# EasyEDA Pro project 双向DCDC.eprj

# Schematic Schematic1
Board Name: Board1; Create Date: 2025-02-20
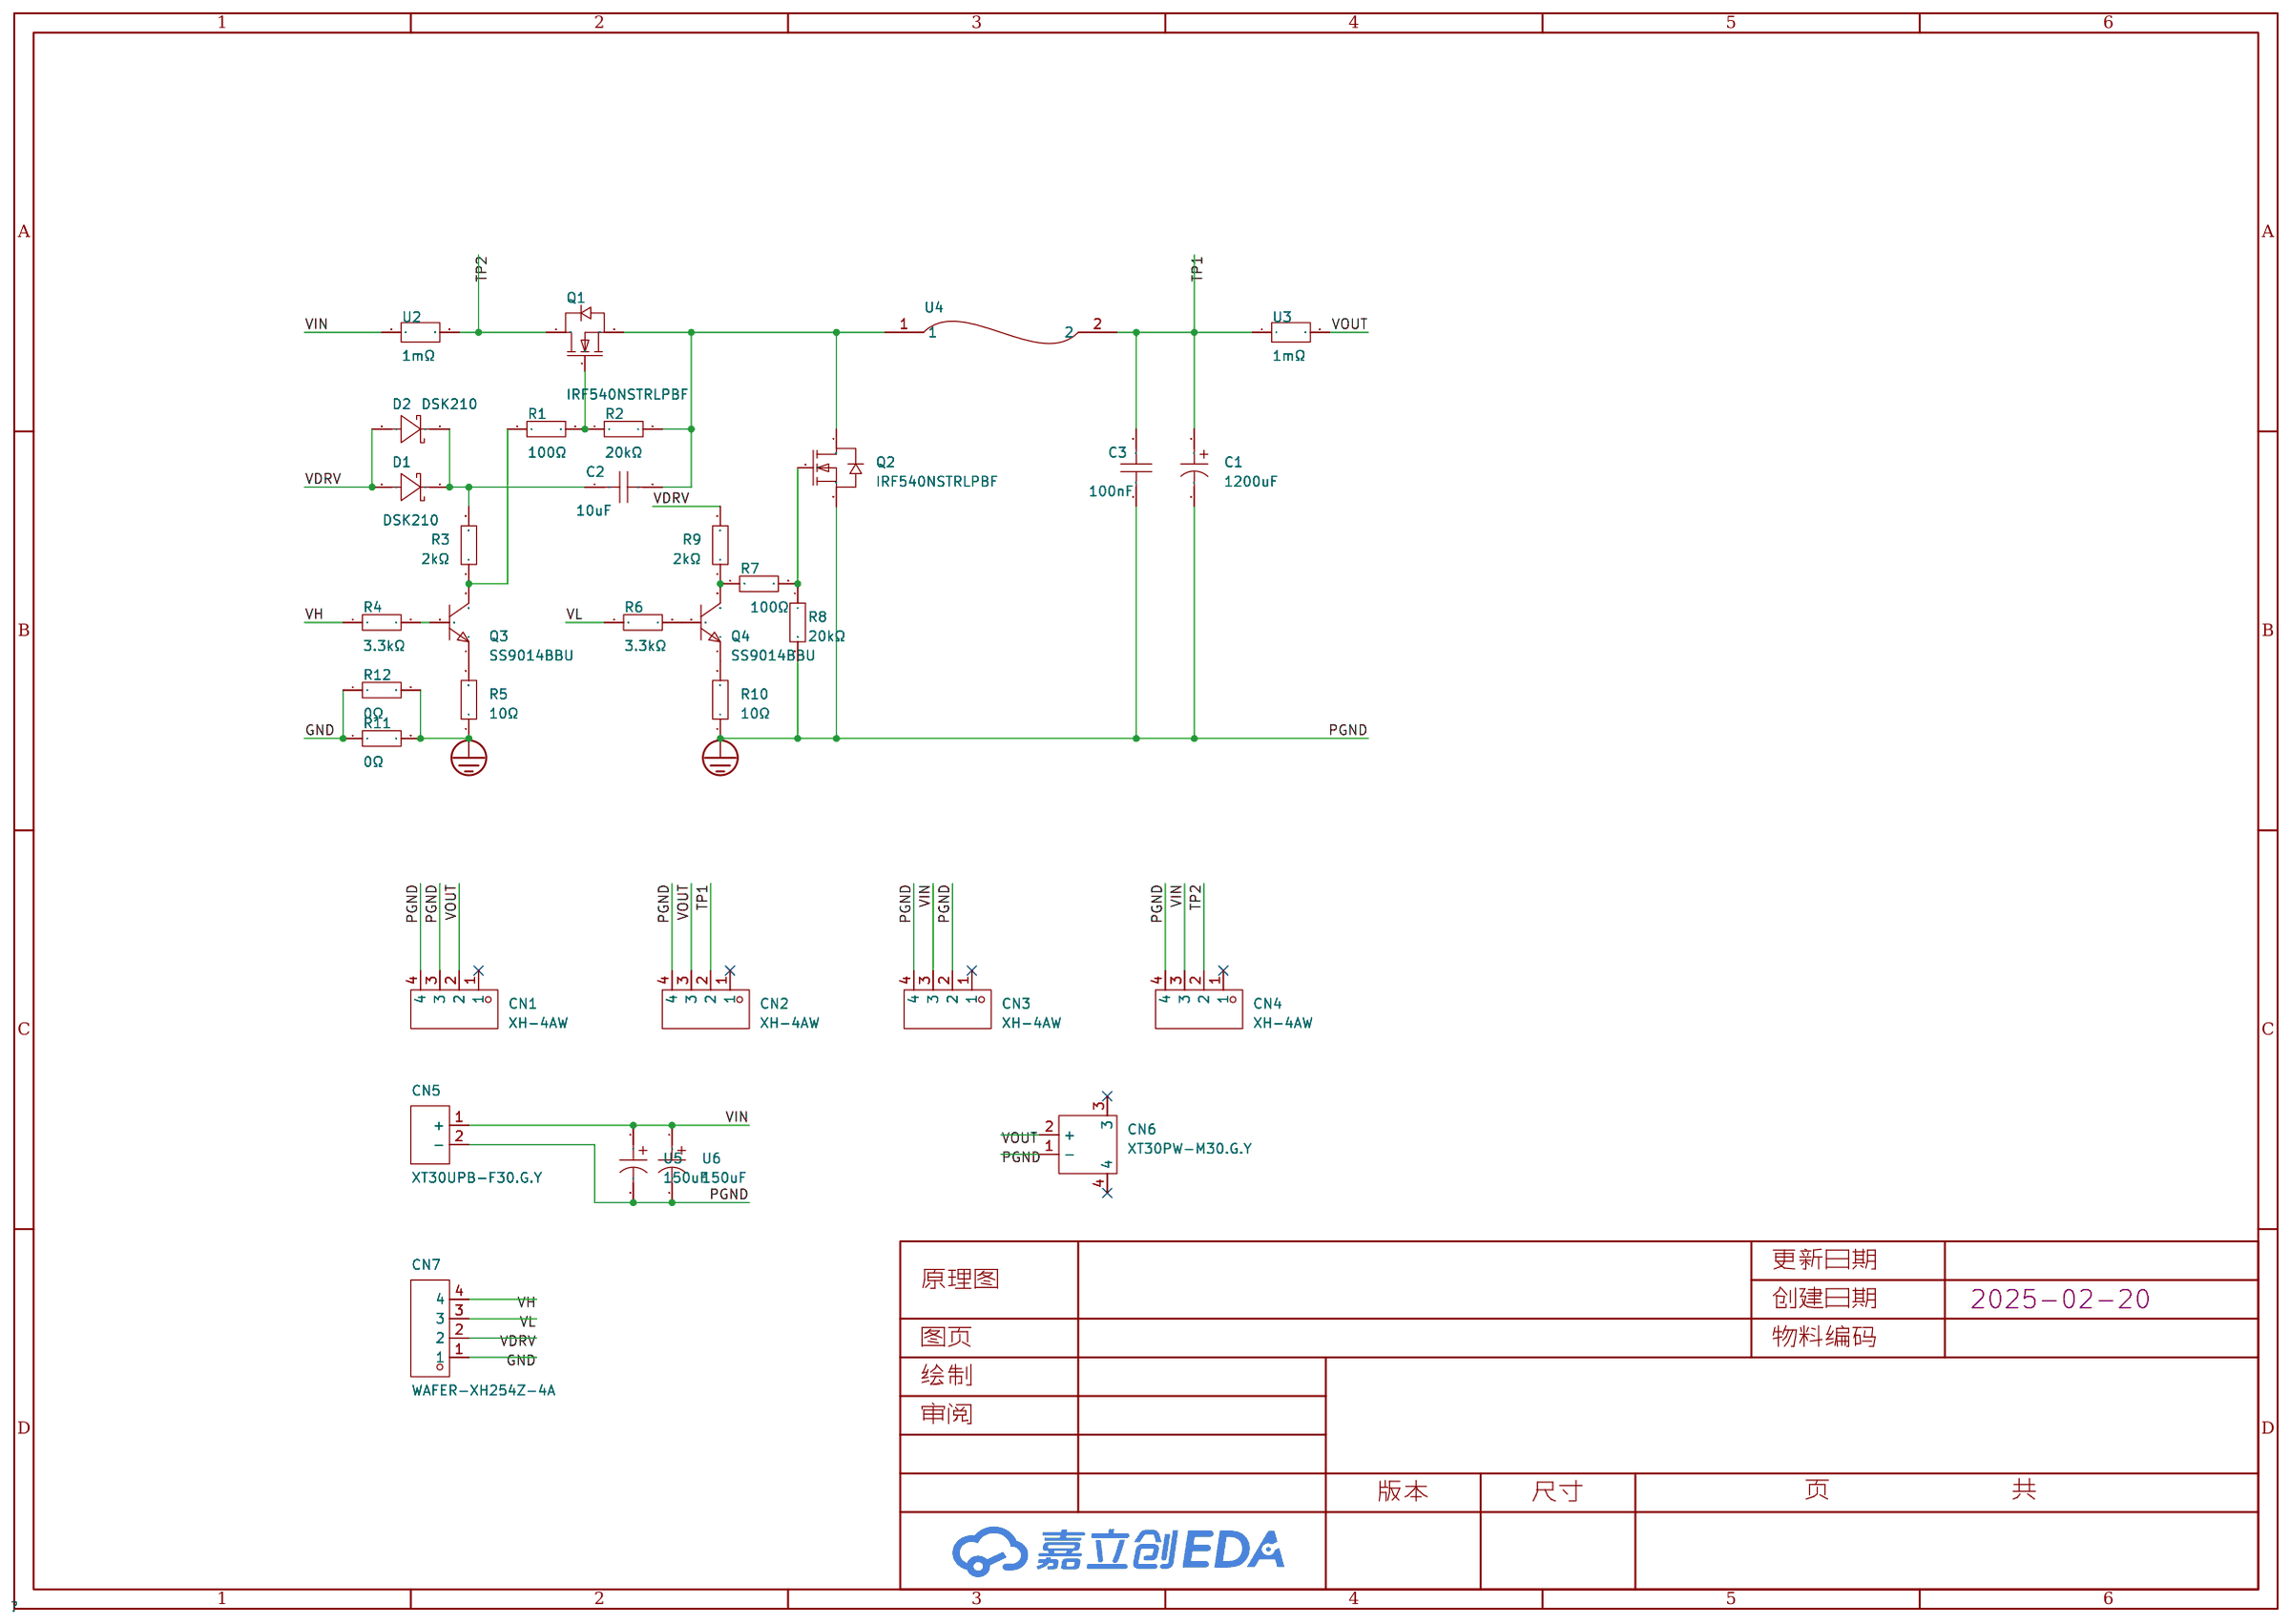
[diagram p0: schematic sheet]

## Parts
C1  1200uF  [CAP-TH_BD18.0-P7.50-D0.8-FD]
C2  10uF  [C0805]
C3  100nF  [C0805]
CN1  XH-4AW  [CONN-TH_XH-4AW]
CN2  XH-4AW  [CONN-TH_XH-4AW]
CN3  XH-4AW  [CONN-TH_XH-4AW]
CN4  XH-4AW  [CONN-TH_XH-4AW]
CN5  XT30UPB-F30.G.Y  [CONN-TH_XT30UPB-F]
CN6  XT30PW-M30.G.Y  [CONN-TH_XT30PW-M]
CN7  WAFER-XH254Z-4A  [CONN-TH_XH-4A]
D1  DSK210  [SOD-123FL_L2.7-W1.8-LS3.8-RD]
D2  DSK210  [SOD-123FL_L2.7-W1.8-LS3.8-RD]
Q1  IRF540NSTRLPBF  [TO-263-2_L10.0-W9.1-P5.08-LS15.2-TL]
Q2  IRF540NSTRLPBF  [TO-263-2_L10.0-W9.1-P5.08-LS15.2-TL]
Q3  SS9014BBU  [TO-92-3_L4.8-W3.7-P1.27-L-1]
Q4  SS9014BBU  [TO-92-3_L4.8-W3.7-P1.27-L-1]
R1  100Ω  [R0805]
R2  20kΩ  [R0805]
R3  2kΩ  [R0805]
R4  3.3kΩ  [R0805]
R5  10Ω  [R1206]
R6  3.3kΩ  [R0805]
R7  100Ω  [R0805]
R8  20kΩ  [R0805]
R9  2kΩ  [R0805]
R10  10Ω  [R1206]
R11  0Ω  [R0805]
R12  0Ω  [R0805]
U2  1mΩ  [R2512]
U3  1mΩ  [R2512]
U4  -  [HLD2920]
U5  150uF  [CAP-TH_BD18.0-P7.50-D0.8-FD]
U6  150uF  [CAP-TH_BD18.0-P7.50-D0.8-FD]

## Library data of the parts
C1 = NXA63V1200M18*31.5 LO: LCSC Part Name: 1200uF ±20% 63V; Supplier Part: C2835718; Manufacturer: SAMYOUNG(韩国三莹); Supplier Footprint: 插件,D18xL31.5mm; JLCPCB Part Class: 扩展库; Datasheet: https://atta.szlcsc.com/upload/public/pdf/source/20210604/C2835744_7DC3C8C5581270645FE6BA7E0F608A85.pdf; Supplier: LCSC; Tolerance: ±20%; Voltage Rated: 63V; Ripple Current: 665mA@100kHz; Equivalent Series Resistance(ESR): 160mΩ@100kHz; Lead Spacing: 7.5mm; Diameter: 18mm; Height - Seated (Max): 31.5mm; Lifetime @ Temp: 10000hrs@105℃; Operating Temperature: -40℃~+105℃
C2 = GRM21BR61H106KE43L: LCSC Part Name: 10uF ±10% 50V; Supplier Part: C440198; Manufacturer: muRata(村田); Supplier Footprint: 0805; JLCPCB Part Class: 基础库; Datasheet: https://atta.szlcsc.com/upload/public/pdf/source/20230811/95AAE0C9AF55EDC31B7A4D8B733F534E.pdf; Supplier: LCSC; Tolerance: ±10%; Voltage Rated: 50V; Temperature Coefficient: X5R
C3 = CC0805KRX7R9BB104: LCSC Part Name: 100nF ±10% 50V; Supplier Part: C49678; Manufacturer: YAGEO(国巨); Supplier Footprint: 0805; JLCPCB Part Class: 基础库; Datasheet: https://atta.szlcsc.com/upload/public/pdf/source/20180224/C181747_15194369449651363981.pdf; Supplier: LCSC; Tolerance: ±10%; Voltage Rated: 50V; Temperature Coefficient: X7R
CN1-CN4 = XH-4AW: LCSC Part Name: 1x4P 间距:2.54mm 弯插 系列:XH; Supplier Part: C2908613; Manufacturer: HCTL(华灿天禄); Supplier Footprint: 弯插,P=2.5mm; JLCPCB Part Class: 扩展库; Datasheet: https://atta.szlcsc.com/upload/public/pdf/source/20230711/B565BAF3B11666EF6B81B3605408F2BD.pdf; Supplier: LCSC; Pins Structure: 1x4P; Pitch: 2.54mm; Mounting Style: 弯插; Reference Series: XH; Number of Pins: 4P; Number of Rows: 1; Number of PINs Per Row: 4; Current Rating (Max): 3A; Contact Material: 黄铜; Contact Plating: 锡; Operating Temperature Range: -25℃~+85℃
CN5 = XT30UPB-F30.G.Y: LCSC Part Name: AMASS(艾迈斯)直立焊板式连接器XT30UPB30-F.G.*; Supplier Part: C108769; Manufacturer: AMASS(艾迈斯); JLCPCB Part Class: 扩展库; Datasheet: https://atta.szlcsc.com/upload/public/pdf/source/20220715/AFD68B9E8B6CA95A7295DBF4AF9325E4.pdf; Supplier: LCSC; Brand: 艾迈斯; Type: 航模插头; Colour: 黄色; RatedVoltage: DC 500V; InterfaceType: 母头; MetalMaterial: 镀金; InsulationMaterial: PA; RatedCurrent: 15A; contact resistance: 0.65mΩ
CN6 = XT30PW-M30.G.Y: LCSC Part Name: AMASS(艾迈斯)航模插头 卧式弯脚 XT30PW-M公头; Supplier Part: C431092; Manufacturer: AMASS(艾迈斯); JLCPCB Part Class: 扩展库; Datasheet: https://atta.szlcsc.com/upload/public/pdf/source/20220222/6A9F22F7850E25B33E1BE430ADF8560B.pdf; Supplier: LCSC; Type: 航模插头; RatedVoltage: DC 500V; InterfaceType: 公头; RatedCurrent: 15A; RecommendedWireGauge: 16/18/20AWG; contact resistance: 1.2mΩ; specifications: 2pin
CN7 = WAFER-XH254Z-4A: Supplier Part: C7432684; Manufacturer: HANBO(汉博); Supplier Footprint: 插件,P=2.5mm; JLCPCB Part Class: 扩展库; Datasheet: https://atta.szlcsc.com/upload/public/pdf/source/20230718/3B4FABA5D38EFB02DAF74E7C2B33D98F.pdf; Supplier: LCSC; Pins Structure: 1x4P; Pitch: 2.54mm; Mounting Style: 直插; Reference Series: XH; Number of Pins: 4P; Number of Rows: 1; Number of PINs Per Row: 4; Current Rating (Max): 3A; Operating Temperature Range: -25℃~+85℃
D1 D2 = DSK210_C7502713: LCSC Part Name: 电压:100V 电流:2A; Supplier Part: C7502713; Manufacturer: 宏迦橙; Supplier Footprint: SOD-123FL; JLCPCB Part Class: 扩展库; Datasheet: https://atta.szlcsc.com/upload/public/pdf/source/20240814/18366EFEA8C1355349286254791BE851.pdf; Supplier: LCSC; Diode Configuration: 独立式; Forward Voltage (Vf@If): 850mV@2A; Reverse Voltage (Vr): 100V; Rectified Current: 2A; Reverse Leakage Current (Ir): 500uA
Q1 Q2 = IRF540NSTRLPBF: LCSC Part Name: 1个N沟道 耐压:100V 电流:33A; Supplier Part: C23982; Manufacturer: Infineon(英飞凌); Supplier Footprint: D2PAK; JLCPCB Part Class: 扩展库; Datasheet: https://atta.szlcsc.com/upload/public/pdf/source/20140304/1457707006167.pdf; Supplier: LCSC; Type: 1个N沟道; Drain Source Voltage (Vdss): 100V; Continuous Drain Current (Id): 33A; Drain Source On Resistance (RDS(on)@Vgs,Id): 44mΩ@10V,16A; Power Dissipation (Pd): 130W; Gate Threshold Voltage (Vgs(th)@Id): 2V@250uA; Total Gate Charge (Qg@Vgs): 71nC; Input Capacitance (Ciss@Vds): 1.96nF; Reverse Transfer Capacitance (Crss@Vds): 40pF; Operating Temperature: -55℃~+175℃
Q3 Q4 = SS9014BBU: Supplier Part: C3201679; Manufacturer: onsemi(安森美); Supplier Footprint: TO-92-3; JLCPCB Part Class: 扩展库; Datasheet: https://atta.szlcsc.com/upload/public/pdf/source/20230915/876D150E45002D61DA6E9B0FBE5B5A11.pdf; Supplier: LCSC; type: NPN; Current - Collector(Ic): 100mA; Collector - Emitter Voltage VCEO: 45V; Pd - Power Dissipation(Pd): 450mW; DC Current Gain (hFE@Ic,Vce): 100@1mA,5V; Transition frequency(fT): 270MHz; Current - Collector Cutoff: 50nA; Collector-Emitter Saturation Voltage (VCE(sat)@Ic,Ib): 300mV@100mA,5mA
R1 R7 = 0805W8F1000T5E: LCSC Part Name: 100Ω ±1% 125mW 厚膜电阻; Supplier Part: C17408; Manufacturer: UNI-ROYAL(厚声); Supplier Footprint: 0805; JLCPCB Part Class: 基础库; Datasheet: https://atta.szlcsc.com/upload/public/pdf/source/20200306/C422600_1E6D84923E4A46A82E41ADD87F860B5C.pdf; Supplier: LCSC; Type: 厚膜电阻; Tolerance: ±1%; Power(Watts): 125mW; Overload Voltage (Max): 150V; Temperature Coefficient: ±100ppm/℃; Operating Temperature Range: -55℃~+155℃
R2 R8 = 0805W8F2002T5E: LCSC Part Name: 20kΩ ±1% 125mW 厚膜电阻; Supplier Part: C4328; Manufacturer: UNI-ROYAL(厚声); Supplier Footprint: 0805; JLCPCB Part Class: 基础库; Datasheet: https://atta.szlcsc.com/upload/public/pdf/source/20200306/C422600_1E6D84923E4A46A82E41ADD87F860B5C.pdf; Supplier: LCSC; Type: 厚膜电阻; Tolerance: ±1%; Power(Watts): 125mW; Overload Voltage (Max): 150V; Temperature Coefficient: ±100ppm/℃; Operating Temperature Range: -55℃~+155℃
R3 R9 = 0805W8F2001T5E: LCSC Part Name: 2kΩ ±1% 125mW 厚膜电阻; Supplier Part: C17604; Manufacturer: UNI-ROYAL(厚声); Supplier Footprint: 0805; JLCPCB Part Class: 基础库; Datasheet: https://atta.szlcsc.com/upload/public/pdf/source/20200306/C422600_1E6D84923E4A46A82E41ADD87F860B5C.pdf; Supplier: LCSC; Type: 厚膜电阻; Tolerance: ±1%; Power(Watts): 125mW; Overload Voltage (Max): 150V; Temperature Coefficient: ±100ppm/℃; Operating Temperature Range: -55℃~+155℃
R4 R6 = 0805W8F3301T5E: LCSC Part Name: 3.3kΩ ±1% 125mW 厚膜电阻; Supplier Part: C26010; Manufacturer: UNI-ROYAL(厚声); Supplier Footprint: 0805; JLCPCB Part Class: 基础库; Datasheet: https://atta.szlcsc.com/upload/public/pdf/source/20200306/C422600_1E6D84923E4A46A82E41ADD87F860B5C.pdf; Supplier: LCSC; Type: 厚膜电阻; Tolerance: ±1%; Power(Watts): 125mW; Overload Voltage (Max): 150V; Temperature Coefficient: ±100ppm/℃; Operating Temperature Range: -55℃~+155℃
R5 R10 = 1206W4F100JT5E: LCSC Part Name: 10Ω ±1% 250mW 厚膜电阻; Supplier Part: C17903; Manufacturer: UNI-ROYAL(厚声); Supplier Footprint: 1206; JLCPCB Part Class: 基础库; Datasheet: https://atta.szlcsc.com/upload/public/pdf/source/20200306/C422600_1E6D84923E4A46A82E41ADD87F860B5C.pdf; Supplier: LCSC; Type: 厚膜电阻; Tolerance: ±1%; Power(Watts): 250mW; Overload Voltage (Max): 200V; Temperature Coefficient: ±400ppm/℃; Operating Temperature Range: -55℃~+155℃
R11 R12 = 0805W8F0000T5E: LCSC Part Name: 0Ω ±1% 125mW 厚膜电阻; Supplier Part: C17477; Manufacturer: UNI-ROYAL(厚声); Supplier Footprint: 0805; JLCPCB Part Class: 基础库; Datasheet: https://atta.szlcsc.com/upload/public/pdf/source/20200306/C422600_1E6D84923E4A46A82E41ADD87F860B5C.pdf; Supplier: LCSC; Type: 厚膜电阻; Tolerance: ±1%; Power(Watts): 125mW; Overload Voltage (Max): 150V; Temperature Coefficient: ±800ppm/℃; Operating Temperature Range: -55℃~+155℃
U2 U3 = PSRP25M6FR001: LCSC Part Name: 1mΩ ±1% 6W; Supplier Part: C21261083; Manufacturer: prosemi(普罗森美); Supplier Footprint: 2512; JLCPCB Part Class: 扩展库; Datasheet: https://atta.szlcsc.com/upload/public/pdf/source/20240306/7D2E986C10D0C8DCEE04989A88848219.pdf; Supplier: LCSC; Type: 合金电阻; Tolerance: ±1%; Power(Watts): 6W
U4 = 功率电感
U5 U6 = CD1101572GM1836VFL: LCSC Part Name: 150uF 400V; Supplier Part: C7493882; Manufacturer: HRK(鸿瑞凯电子); Supplier Footprint: 插件,D18xL36mm; JLCPCB Part Class: 扩展库; Supplier: LCSC; Rated Voltage: 400V

## Nets
GND: CN7.1 R11.1 R12.1
PGND: C1.2 C3.1 CN1.3 CN1.4 CN2.4 CN3.2 CN3.4 CN4.4 CN5.2(-) CN6.1(-) Q2.3(S) R5.1 R8.2 R10.1 R11.2 R12.2 U5.2 U6.2
VIN: CN3.3 CN4.3 CN5.1(+) U2.1 U5.1 U6.1
TP1: C1.1 C3.2 CN2.2 U3.1 U4.2
TP2: CN4.2 Q1.4(D) U2.2
VDRV: CN7.2 D1.2(A) D2.2(A) R9.2
VH: CN7.4 R4.1
VL: CN7.3 R6.1
VOUT: CN1.2 CN2.3 CN6.2(+) U3.2
$1N502: C2.2 Q1.3(S) Q2.4(D) R2.2 U4.1
$1N763: Q1.1(G) R1.2 R2.1
$1N854: Q3.3(C) R1.1 R3.1
$1N934: C2.1 D1.1(K) D2.1(K) R3.2
$1N1487: Q3.2(B) R4.2
$1N2229: Q2.1(G) R7.2 R8.1
$1N2236: Q4.3(C) R7.1 R9.1
$1N3503: Q3.1(E) R5.2
$1N3547: Q4.2(B) R6.2
$1N3549: Q4.1(E) R10.2

Not connected (* = marked no-connect by the designer): CN1 1*; CN2 1*; CN3 1*; CN4 1*; CN6 3* 4*

# Board PCB1
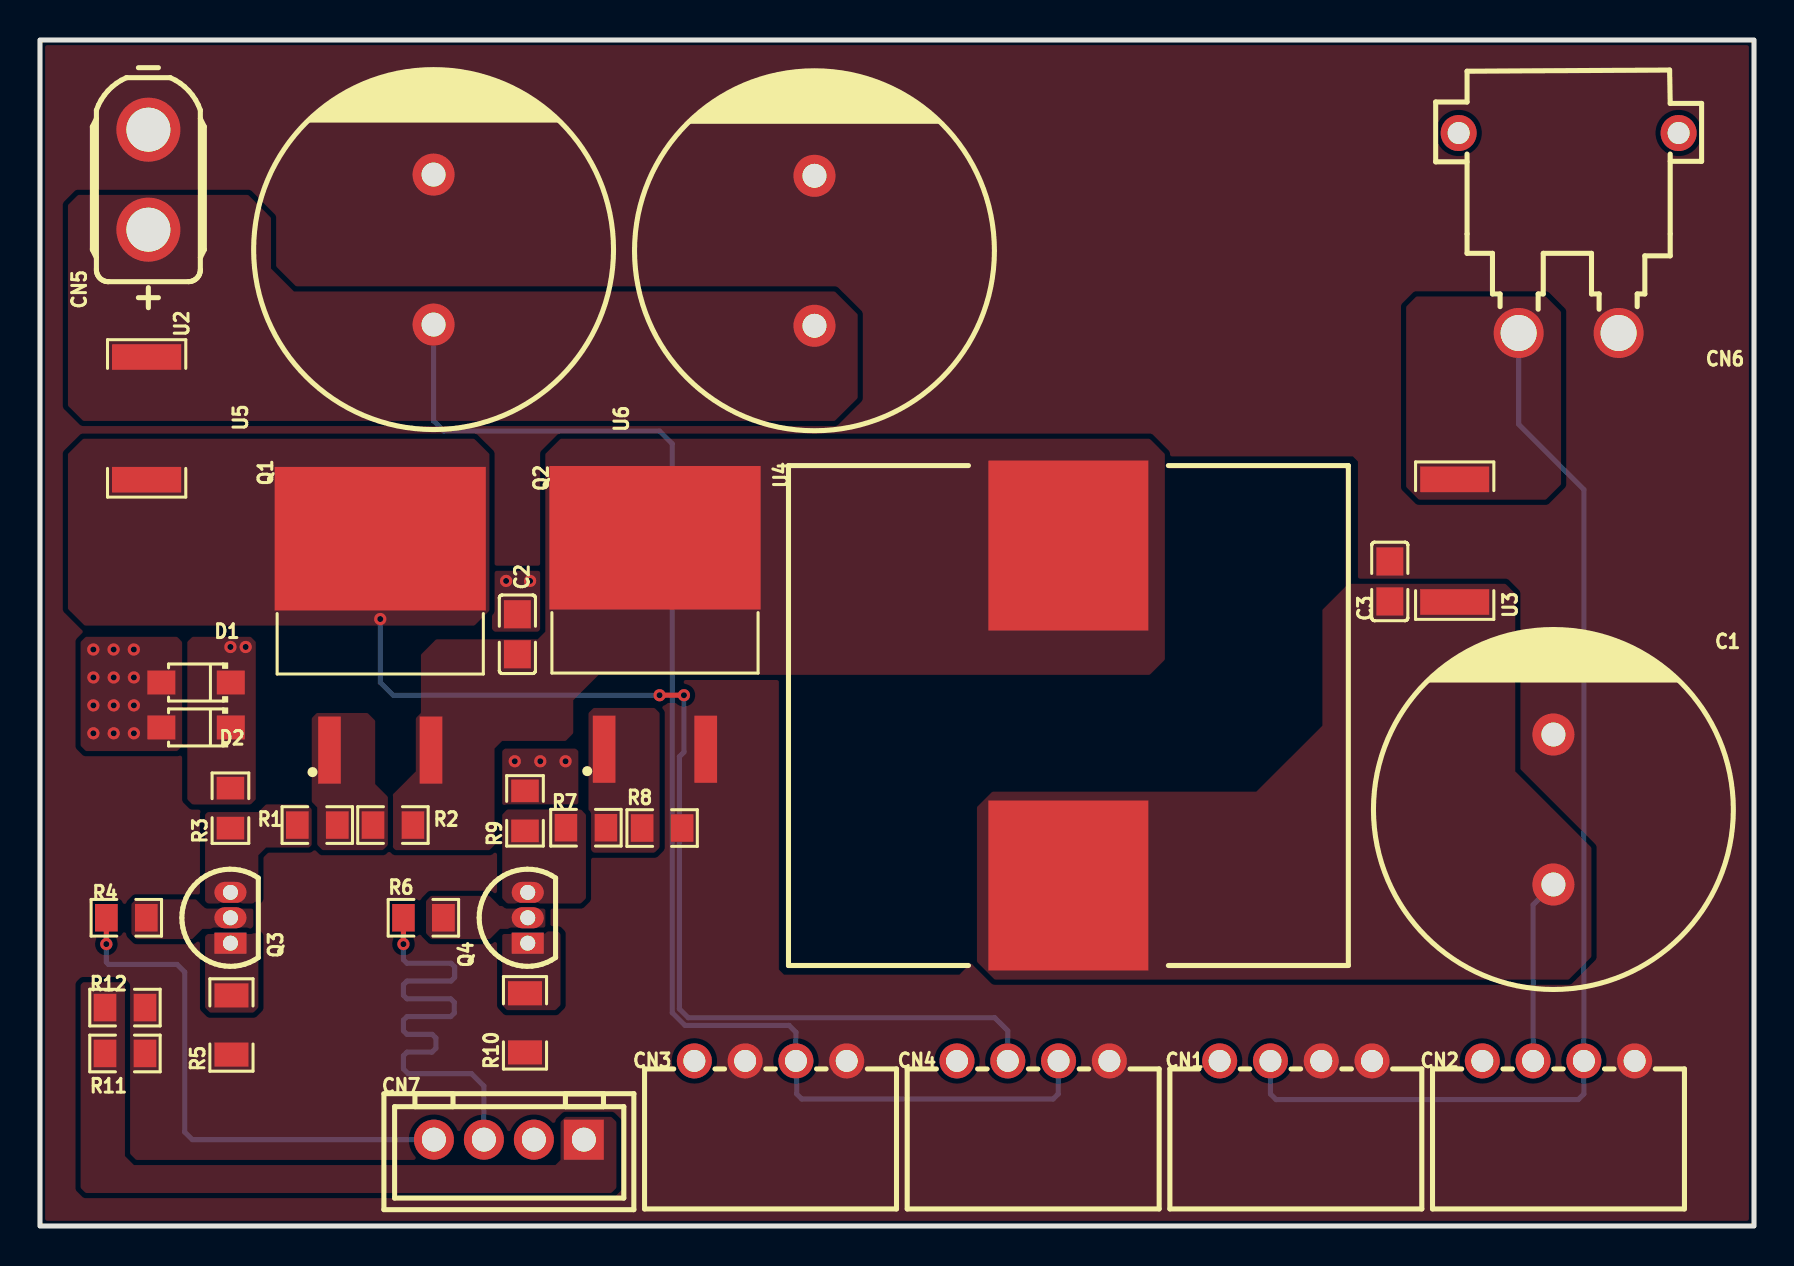
[diagram p1: board, top side]
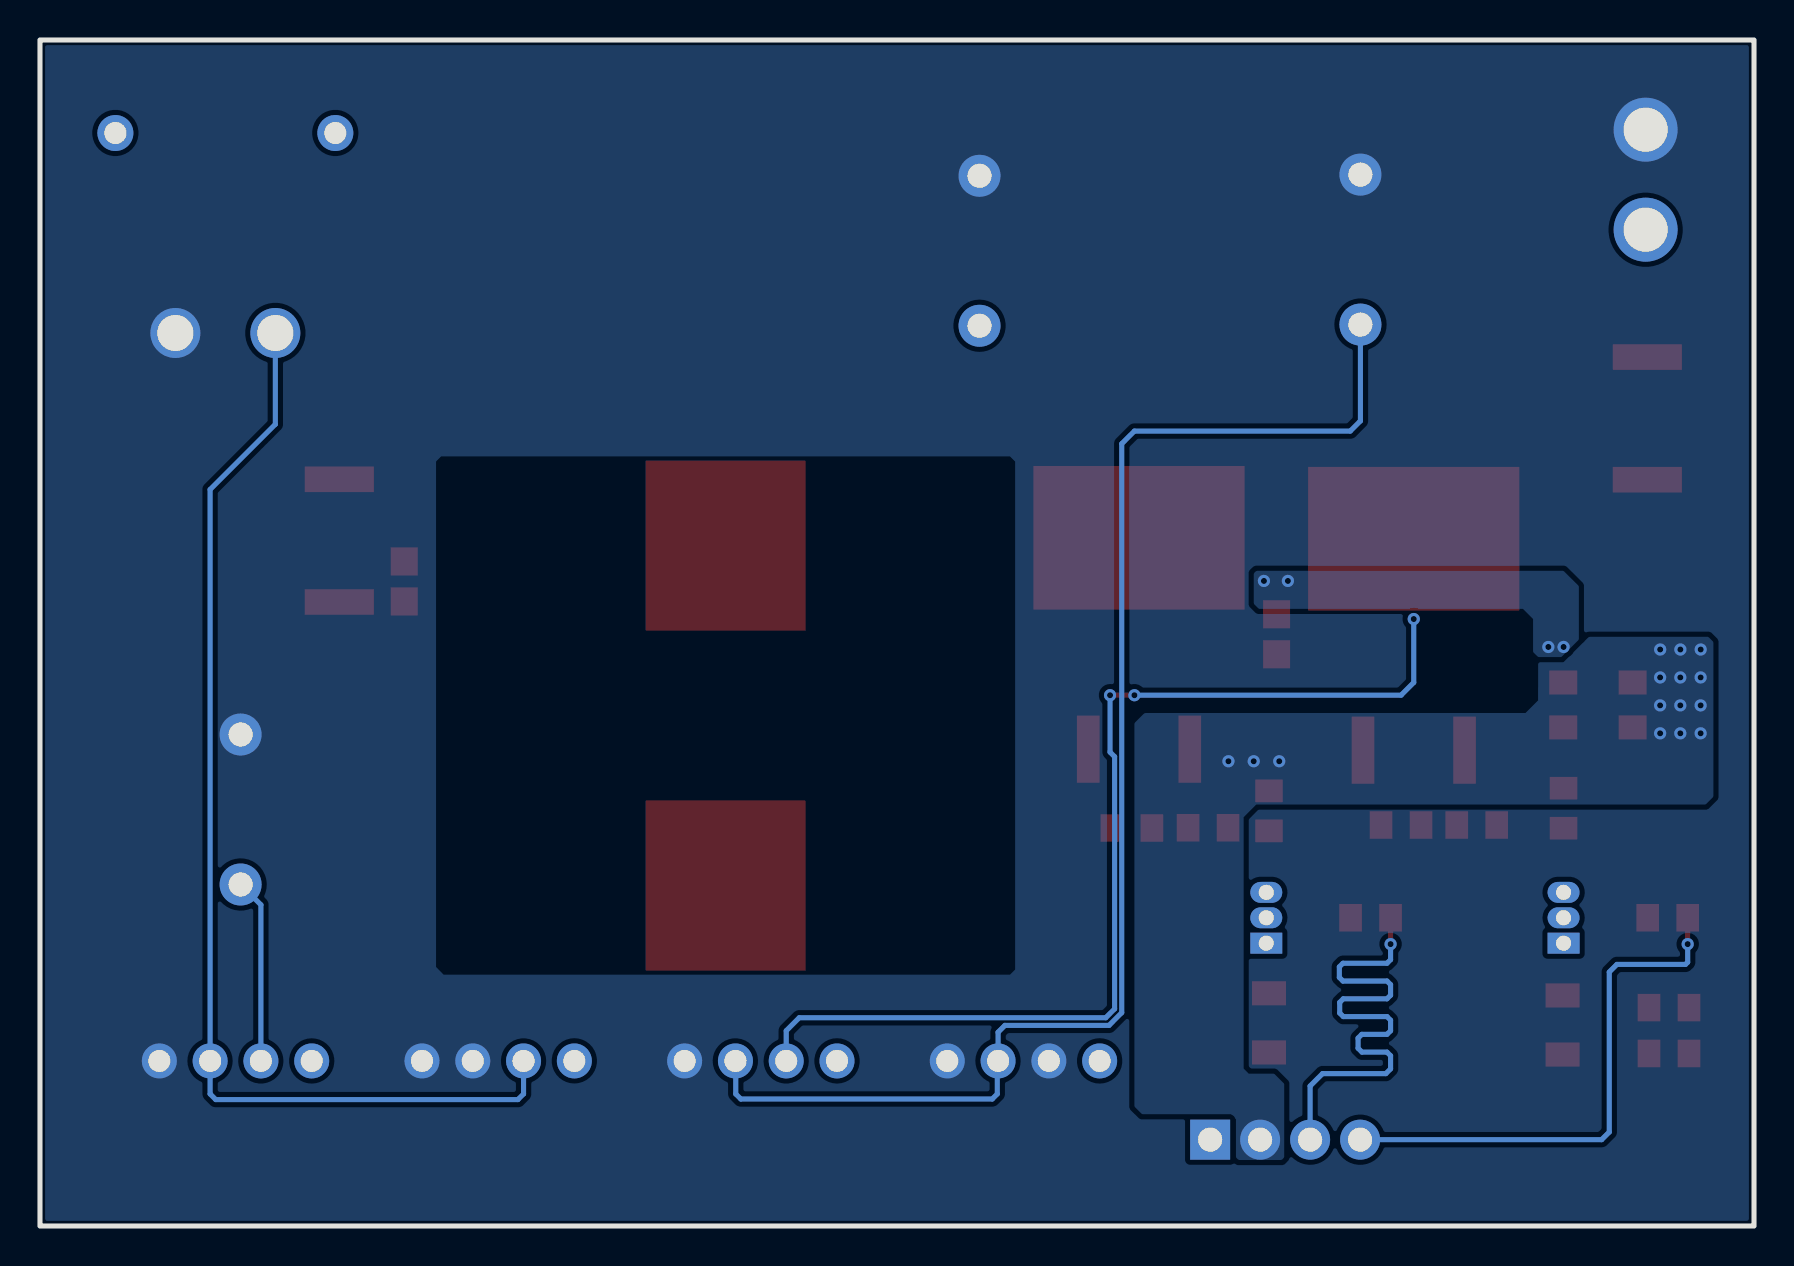
[diagram p2: board, bottom side, seen from below]

Outline 85.72 x 59.31 mm; copper layers: Top Layer, Bottom Layer. Coordinates in mm from the lower left corner of the outline.
Outline path: rectangle 0,59.31 85.72,0
Stack: Top Layer 0.035mm / Dielectric1 1.51mm FR4 er 4.5 / Bottom Layer 0.035mm

## Design rules (mm)
net VH: DP1
net VL: DP1
template: 自定义配置
spacing copperThickness1oz (default): track to track 0.102, other pairs 0.152 to 0.3
spacing copperThickness2oz: track to track 0.203, other pairs 0.152 to 0.3
track width copperThickness1oz (default): min 0.127, default 0.254, max 2.54
track width copperThickness2oz: min 0.203, default 0.254, max 2.54
differential pair differentialPair (default): width min 0.127, default 0.254, max 2.54; gap min 0.152, default 0.152
via viaSize (default): diameter min 0.5, default 0.61, max 10; hole min 0.3, default 0.305, max 6.3
net PGND uses copperRegion1
net $1N502 uses copperRegion1
net $1N934 uses copperRegion1
net VDRV uses copperRegion1
net $1N763 uses copperRegion1
net $1N2229 uses copperRegion1
net $1N854 uses copperRegion1
net $1N1487 uses copperRegion1
net $1N3503 uses copperRegion1
net $1N2236 uses copperRegion1
net $1N3547 uses copperRegion1
net $1N3549 uses copperRegion1
net GND uses copperRegion1
net VIN uses copperRegion1
net VOUT uses copperRegion1
net TP1 uses copperRegion1
net TP2 uses copperRegion1

## Placement (name value [footprint] x y rotation side)
C1  1200uF  [CAP-TH_BD18.0-P7.50-D0.8-FD]  75.69 20.83 90 top
C2  10uF  [C0805]  23.88 29.59 270 top
C3  100nF  [C0805]  67.51 32.23 270 top
CN1  XH-4AW  [CONN-TH_XH-4AW]  62.81 8.25 0 top
CN2  XH-4AW  [CONN-TH_XH-4AW]  75.95 8.25 0 top
CN3  XH-4AW  [CONN-TH_XH-4AW]  36.54 8.25 0 top
CN4  XH-4AW  [CONN-TH_XH-4AW]  49.67 8.25 0 top
CN5  XT30UPB-F30.G.Y  [CONN-TH_XT30UPB-F]  5.42 52.32 90 top
CN6  XT30PW-M30.G.Y  [CONN-TH_XT30PW-M]  76.45 49.66 180 top
CN7  WAFER-XH254Z-4A  [CONN-TH_XH-4A]  23.45 4.32 180 top
D1  DSK210  [SOD-123FL_L2.7-W1.8-LS3.8-RD]  7.81 27.18 180 top
D2  DSK210  [SOD-123FL_L2.7-W1.8-LS3.8-RD]  7.81 24.93 180 top
Q1  IRF540NSTRLPBF  [TO-263-2_L10.0-W9.1-P5.08-LS15.2-TL]  17.02 29.08 90 top
Q2  IRF540NSTRLPBF  [TO-263-2_L10.0-W9.1-P5.08-LS15.2-TL]  30.76 29.13 90 top
Q3  SS9014BBU  [TO-92-3_L4.8-W3.7-P1.27-L-1]  9.52 15.41 90 top
Q4  SS9014BBU  [TO-92-3_L4.8-W3.7-P1.27-L-1]  24.39 15.41 90 top
R1  100Ω  [R0805]  13.87 20.05 0 top
R2  20kΩ  [R0805]  17.65 20.05 0 top
R3  2kΩ  [R0805]  9.52 20.89 90 top
R4  3.3kΩ  [R0805]  4.32 15.41 0 top
R5  10Ω  [R1206]  9.58 10.05 90 top
R6  3.3kΩ  [R0805]  19.18 15.41 0 top
R7  100Ω  [R0805]  27.31 19.92 0 top
R8  20kΩ  [R0805]  31.11 19.9 0 top
R9  2kΩ  [R0805]  24.26 20.76 90 top
R10  10Ω  [R1206]  24.26 10.16 90 top
R11  0Ω  [R0805]  4.25 8.63 0 top
R12  0Ω  [R0805]  4.25 10.92 0 top
U2  1mΩ  [R2512]  5.33 40.39 270 top
U3  1mΩ  [R2512]  70.75 34.27 90 top
U4  -  [HLD2920]  51.44 25.53 0 top
U5  150uF  [CAP-TH_BD18.0-P7.50-D0.8-FD]  19.68 48.83 90 top
U6  150uF  [CAP-TH_BD18.0-P7.50-D0.8-FD]  38.73 48.77 90 top

## Footprints (pads in the part's own frame, mm; a bottom-side part is the same pattern mirrored in y, then rotated)
C0805
  rect 1.41x1.35 smd: 1(-1,0) 2(1,0)
CAP-TH_BD18.0-P7.50-D0.8-FD
  round 2.1 hole 1.2: 1(-3.75,0) 2(3.75,0)
CONN-TH_XH-4A
  rect 2x2 hole 1.2: 1(-3.75,0)
  round 2 hole 1.2: 2(-1.25,0) 3(1.25,0) 4(3.75,0)
CONN-TH_XH-4AW
  round 1.75 hole 1.1: 1(-3.81,0) 2(-1.27,0) 3(1.27,0) 4(3.81,0)
CONN-TH_XT30PW-M
  round 2.5 hole 1.8: 1(-2.5,5) 2(2.5,5)
  round 1.8 hole 1.1: 3(5.5,-5) 4(-5.5,-5)
CONN-TH_XT30UPB-F
  round 3.2 hole 2.2: 1(-2.5,0) 2(2.5,0)
HLD2920
  custom 8x8.5 smd: 1(0,8.5) 2(0,-8.5)
R0805
  rect 1.133x1.377 smd: 1(-1,0) 2(1,0)
R1206
  rect 1.208x1.701 smd: 1(-1.479,0) 2(1.479,0)
R2512
  rect 1.282x3.456 smd: 1(-3.067,0) 2(3.067,0)
SOD-123FL_L2.7-W1.8-LS3.8-RD
  rect 1.4x1.2 smd: 1(-1.735,0) 2(1.735,0)
TO-92-3_L4.8-W3.7-P1.27-L-1
  rect 1.05x1.6 hole 0.75: 1(-1.27,0)
  oval 1.05x1.6 hole 0.75: 2(0,0) 3(1.27,0)
TO-263-2_L10.0-W9.1-P5.08-LS15.2-TL
  rect 3.358x1.134 smd: 1(-5.286,2.54) 3(-5.286,-2.54)
  rect 7.181x10.566 smd: 4(5.286,0)

## Nets
As in the schematic.

Pads without a net: CN1 1; CN2 1; CN3 1; CN4 1; CN6 3 4

## Via types
v1: diameter 0.61, hole 0.305, Top Layer to Bottom Layer, 24 vias

## Routing (per net, layer and track width the routed paths; a pad name or vN(x,y) marks a point on that pad's centre or on a via; arc(x,y) is an arc through that point)
VIN: length 70.3
  Bottom Layer w0.254: CN4.3 50.93,8.24 50.93,6.6 50.67,6.35 38.1,6.35 37.85,6.6 37.85,8.22 CN3.3 37.81,9.69 37.47,10.03 32.26,10.03 31.62,10.67 31.62,39.12 30.99,39.75 20.19,39.75 19.68,40.26 U5.1
TP1: length 9.2
  Bottom Layer w0.254: C1.1 74.68,16.06 CN2.2
TP2: length 52.8
  Top Layer w0.254: v1(32.21,26.54) v1(30.99,26.54)
  Bottom Layer w0.254: v1(17.02,30.35) 17.02,27.18 17.65,26.54 v1(30.99,26.54) ; v1(32.21,26.54) 32.21,23.7 31.98,23.47 31.98,10.86 32.42,10.41 47.75,10.41 48.4,9.76 CN4.2
VDRV:
  vias: v1(2.67,28.83) v1(2.67,27.43) v1(2.67,26.04) v1(2.67,24.64) v1(3.68,28.83) v1(3.69,27.43) v1(3.69,26.04) v1(3.69,24.64) v1(4.69,28.83) v1(4.7,27.43) v1(4.7,26.04) v1(4.7,24.64) v1(23.75,23.24) v1(25.02,23.24) v1(26.29,23.24)
VH: length 27
  Top Layer w0.254: R4.1 v1(3.32,14.1)
  Bottom Layer w0.254: v1(3.32,14.1) 3.32,13.19 3.43,13.08 6.86,13.08 7.24,12.7 7.24,4.7 7.62,4.32 CN7.4
VL: length 26.8
  Top Layer w0.254: R6.1 v1(18.18,14.1)
  Bottom Layer w0.254: CN7.3 22.2,7 21.58,7.62 18.41,7.62 18.18,7.86 18.18,8.52 18.36,8.69 19.61,8.69 19.8,8.89 19.8,9.4 19.62,9.58 18.36,9.58 18.18,9.76 18.18,10.29 18.36,10.47 20.54,10.47 20.72,10.65 20.72,11.18 20.54,11.36 18.36,11.36 18.18,11.54 18.18,12.07 18.36,12.25 20.56,12.25 20.74,12.43 20.74,12.96 20.56,13.14 18.36,13.14 18.18,13.32 v1(18.18,14.1)
VOUT: length 57
  Bottom Layer w0.254: CN6.2 73.95,40.09 77.22,36.83 CN2.3 77.22,6.6 76.93,6.32 61.82,6.32 61.54,6.6 CN1.2
$1N934:
  vias: v1(9.52,28.96) v1(10.29,28.96) v1(23.31,32.26) v1(24.51,32.26)

## Copper pours and planes (outline as drawn; the poured copper is in the pictures)
GND on Top Layer: 4.25,12.01 4.06,12.19 2.16,12.19 2.03,12.06 2.03,1.91 2.29,1.65 28.57,1.65 28.83,1.91 28.83,5.21 28.57,5.46 26.29,5.46 26.03,5.21 26.03,3.3 25.78,3.05 4.7,3.05 4.25,3.5
PGND on Top Layer: 0,59.31 85.72,59.31 85.72,0 0,0
PGND on Bottom Layer: 0,59.31 85.72,59.31 85.72,0 0,0
VIN on Top Layer: 1.9,51.56 10.41,51.56 11.56,50.42 11.56,47.88 12.7,46.74 39.75,46.74 40.89,45.59 40.89,41.4 39.75,40.26 2.16,40.26 1.4,41.02 1.4,51.05
TP1 on Top Layer: 46.86,20.95 47.62,21.72 60.83,21.72 64.13,25.02 64.13,30.81 65.44,32.11 73.3,32.11 73.79,31.62 73.79,22.73 77.6,18.92 77.6,13.46 76.45,12.32 47.75,12.32 46.86,13.21
TP2 on Top Layer: 1.4,38.61 2.16,39.37 21.72,39.37 22.48,38.61 22.48,30.78 21.73,30.02 2.23,30.02 1.4,30.86
VDRV on Top Layer: 23.24,20.95 23.11,21.08 23.11,23.75 23.24,23.88 26.8,23.88 26.92,23.75 26.92,21.08 26.8,20.95
VDRV on Top Layer: 2.29,29.46 6.86,29.46 7.11,29.21 7.11,24 6.86,23.75 2.29,23.75 2.03,24.01 2.03,29.21
VDRV on Bottom Layer: 25.91,3.43 25.78,3.3 23.62,3.3 23.49,3.43 23.49,7.11 24,7.62 25.27,7.62 25.53,7.87 25.53,20.44 24.89,21.07 2.42,21.07 2.03,21.46 2.03,29.21 2.29,29.46 8.25,29.46 10.79,26.92 10.79,26.29 11.43,25.65 30.48,25.65 30.99,25.15 30.99,5.97 30.61,5.59 26.16,5.59 25.91,5.33
VDRV on Bottom Layer: 9.4,28.32 10.67,28.32 10.79,28.19 10.79,26.29 10.67,26.16 9.52,26.16 9.4,26.29
VOUT on Top Layer: 68.33,36.96 68.96,36.32 75.31,36.32 76.07,37.08 76.07,45.72 75.31,46.48 68.83,46.48 68.33,45.97
$1N502 on Top Layer: 17.53,21.46 18.8,22.73 18.8,25.4 19.05,25.65 19.05,28.58 19.81,29.34 24.89,29.34 25.27,29.72 25.27,38.61 26.03,39.37 55.5,39.37 56.26,38.61 56.26,28.32 55.5,27.56 27.94,27.56 26.67,26.29 26.67,24.64 26.29,24.26 23.11,24.26 22.73,23.88 22.73,19.05 22.48,18.8 17.78,18.8 17.53,19.05
$1N763 on Top Layer: 13.59,25.4 13.84,25.65 16.38,25.65 16.76,25.27 16.76,22.1 17.4,21.46 17.4,19.05 17.14,18.8 14.13,18.8 13.87,19.06 13.87,20.93 13.59,21.21
$1N854 on Top Layer: 8.38,20.7 10.92,20.7 11.3,21.08 13.46,21.08 13.59,20.95 13.59,19.05 13.46,18.92 11.3,18.92 10.92,18.54 10.92,16.38 10.67,16.13 8.38,16.13 8.25,16.26 8.25,20.57
$1N934 on Top Layer: 25.15,29.84 25.02,29.72 22.73,29.72 22.61,29.84 22.61,32.64 22.73,32.77 25.02,32.77 25.15,32.64
$1N934 on Top Layer: 7.37,29.21 7.62,29.46 10.54,29.46 10.79,29.21 10.79,21.34 10.54,21.08 7.62,21.08 7.37,21.34
$1N934 on Bottom Layer: 8.76,28.7 9.02,28.45 10.79,28.45 11.05,28.7 11.05,30.35 11.56,30.86 24.77,30.86 25.02,31.12 25.02,32.64 24.89,32.77 9.52,32.77 8.76,32
$1N1487 on Top Layer: 4.57,16.11 4.79,16.33 7.8,16.33 8.13,16 10.54,16 10.67,15.88 10.67,14.99 10.54,14.86 8.13,14.86 7.62,14.35 4.83,14.35 4.57,14.61
$1N2229 on Top Layer: 27.43,25.65 27.69,25.91 30.73,25.91 30.99,25.65 30.99,18.92 30.73,18.67 27.69,18.67 27.43,18.92
$1N2236 on Top Layer: 23.11,20.57 23.37,20.83 27.05,20.83 27.31,20.58 27.31,16.38 27.05,16.13 23.37,16.13 23.11,16.38
$1N3503 on Top Layer: 8.25,14.48 8.51,14.73 10.67,14.73 10.92,14.49 10.92,10.92 10.67,10.67 8.5,10.67 8.25,10.92
$1N3547 on Top Layer: 19.3,16.26 19.56,16.51 22.48,16.51 22.99,16 25.15,16 25.27,15.88 25.27,14.99 25.15,14.86 23.01,14.86 22.5,14.35 19.59,14.35 19.3,14.63
$1N3549 on Top Layer: 23.11,14.61 23.24,14.73 25.91,14.73 26.03,14.61 26.03,11.05 25.78,10.8 23.35,10.8 23.11,11.05
